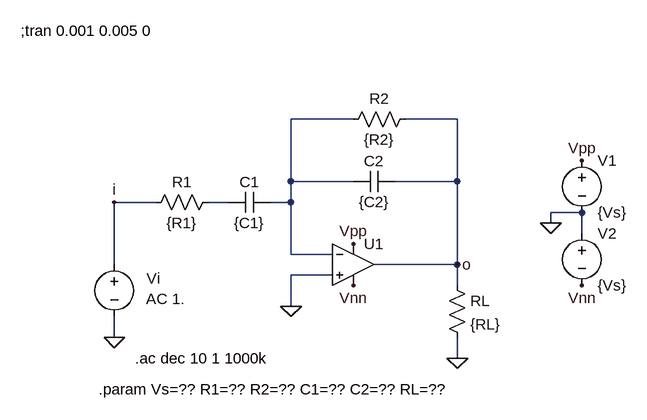
[diagram p0: schematic Filter03Fig.asc]
Filter03Fig.asc, the LTspice schematic file:
Version 4
SHEET 1 968 680
WIRE 160 0 64 0
WIRE 320 0 240 0
WIRE 64 96 64 0
WIRE 160 96 64 96
WIRE 320 96 320 0
WIRE 320 96 224 96
WIRE -144 128 -208 128
WIRE -32 128 -64 128
WIRE 64 128 64 96
WIRE 64 128 32 128
WIRE 512 144 464 144
WIRE 464 160 464 144
WIRE 512 176 512 144
WIRE 64 208 64 128
WIRE 128 208 64 208
WIRE -208 224 -208 128
WIRE 320 224 320 96
WIRE 320 224 192 224
WIRE 128 240 64 240
WIRE 320 256 320 224
WIRE 64 288 64 240
WIRE -208 336 -208 304
WIRE 320 368 320 336
FLAG 512 64 Vpp
FLAG 464 160 0
FLAG 512 256 Vnn
FLAG 320 368 0
FLAG -208 336 0
FLAG 160 192 Vpp
FLAG 160 256 Vnn
FLAG 64 288 0
FLAG 320 224 o
FLAG -208 128 i
SYMBOL voltage 512 48 R0
WINDOW 123 0 0 Left 0
WINDOW 39 0 0 Left 0
SYMATTR InstName V1
SYMATTR Value {Vs}
SYMBOL voltage 512 160 R0
WINDOW 123 0 0 Left 0
WINDOW 39 0 0 Left 0
SYMATTR InstName V2
SYMATTR Value {Vs}
SYMBOL res 304 240 R0
SYMATTR InstName RL
SYMATTR Value {RL}
SYMBOL voltage -208 208 R0
WINDOW 3 49 69 Left 2
WINDOW 123 0 0 Left 0
WINDOW 39 0 0 Left 0
WINDOW 0 50 37 Left 2
SYMATTR Value AC 1.
SYMATTR InstName Vi
SYMBOL Opamps\\UniversalOpamp2 160 224 R0
SYMATTR InstName U1
SYMBOL cap 32 112 R90
WINDOW 0 0 32 VBottom 2
WINDOW 3 32 32 VTop 2
SYMATTR InstName C1
SYMATTR Value {C1}
SYMBOL res -48 112 R90
WINDOW 0 0 56 VBottom 2
WINDOW 3 32 56 VTop 2
SYMATTR InstName R1
SYMATTR Value {R1}
SYMBOL res 256 -16 R90
WINDOW 0 0 56 VBottom 2
WINDOW 3 32 56 VTop 2
SYMATTR InstName R2
SYMATTR Value {R2}
SYMBOL cap 224 80 R90
WINDOW 0 0 32 VBottom 2
WINDOW 3 32 32 VTop 2
SYMATTR InstName C2
SYMATTR Value {C2}
TEXT -232 416 Left 2 !.param Vs=?? R1=?? R2=?? C1=?? C2=?? RL=??
TEXT -352 -136 Left 2 !;tran 0.001 0.005 0
TEXT -176 368 Left 2 !.ac dec 10 1 1000k

The netlist it stands for:
* Filter03Fig.asc
V1 Vpp 0 {Vs}
V2 0 Vnn {Vs}
RL o 0 {RL}
Vi i 0 AC 1.
XU1 0 N001 Vpp Vnn o level.2 Avol=1Meg GBW=10Meg Slew=10Meg ilimit=25m rail=0 Vos=0 phimargin=45 en=0 enk=0 in=0 ink=0 Rin=500Meg  ; pins IN+ IN- V+ V- OUT
C1 N001 N002 {C1}
R1 N002 i {R1}
R2 o N001 {R2}
C2 o N001 {C2}
.param Vs=?? R1=?? R2=?? C1=?? C2=?? RL=??
;tran 0.001 0.005 0
.ac dec 10 1 1000k
.lib UniversalOpamps2.sub
.backanno
.end